# EAGLE design tactswitch (EAGLE 9.1.0)
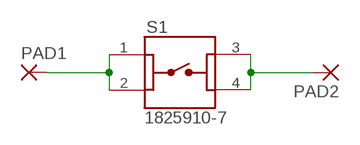
[diagram p0: schematic, sheet 1]

## Parts
PAD1  2,15/1,0  [2,15/1,0]
PAD2  2,15/1,0  [2,15/1,0]
S1  1825910-7  [SW_1825910-7]

## Nets
N$1: PAD1.1(P) S1.1 S1.2
N$2: PAD2.1(P) S1.3 S1.4

## Library data of the parts
PAD1 PAD2 = wirepad:2,15/1,0: THROUGH-HOLE PAD
S1 = tact:1825910-7: Switch Tactile OFF (ON) SPST Round Button PC Pins 0.05A 24VDC 100000Cycles 2.55N Thru-Hole Loose; COMMENT: 1825910-7; CONFIGURATION_POLE-THROW: Single Pole - Single Throw; CONTACT_CURRENT_RATING: 50 mA; DESCRIPTION: FSM4JAH=6MM TACT SWITCH, HIGH TEMP; DIGI-KEY_PART_NUMBER: 450-1804-ND; DIGI-KEY_PURCHASE_URL: https://www.digikey.com/product-detail/en/te-connectivity-alcoswitch-switches/1825910-7/450-1804-ND/1731414?utm_source=snapeda&utm_medium=aggregator&utm_campaign=symbol; EU_ROHS_COMPLIANCE: Compliant; LINK: http://www.te.com/usa-en/product-1825910-7.html; MF: TE Connectivity; MP: 1825910-7; PACKAGE: None

## Board
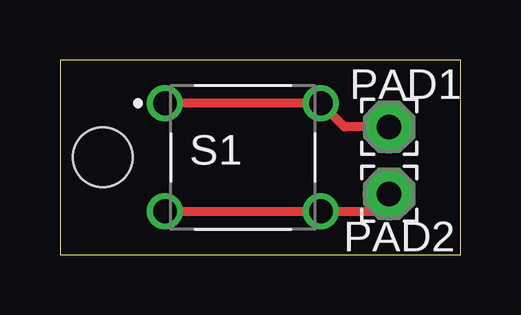
[diagram p1: board, top side]

Size 16.69 x 8.12 mm. Coordinates in mm from the lower left corner, seen from the top.
Outline: 0,0 16.69,0 16.69,8.12 0,8.12 0,0
Copper layers (1*16): Top 0.035mm / dielectric 1.5mm / Bottom 0.035mm
Design rules "oshpark": minimum track width 7mil, minimum drill 10mil, track to track 7mil, track to pad 7mil, pad to pad 7mil, via to via 7mil, smd to smd 6mil, copper to edge 10mil, drill to drill 6mil, minimum pad ring 10mil, minimum via ring 10mil, stop-mask expansion 2mil, vias tented up to drill 0mil, thermal gap 10mil
Holes 2.49 mm at 1.78,4.06

### Footprints (pad centres in the part's own frame; a part is rotated, then mirrored left to right if it is on the bottom)
2,15/1,0 = drill 1.016 pad 2.159 octagon: 1 0,0
SW_1825910-7 = drill 0.99: 1 -3.25,2.25; 2 3.25,2.25; 3 -3.25,-2.25; 4 3.25,-2.25

### Placement (x,y rotation side)
PAD1  13.72,5.33 0 top
PAD2  13.72,2.54 0 top
S1  7.62,4.06 0 top

### Tracks (layer width: path | path; a pad name or v marks a point on that pad's centre or on a via)
N$1
  Top 0.381: PAD1.1 11.85,5.33 S1.2 S1.1
N$2
  Top 0.381: S1.3 S1.4 12.99,1.81 PAD2.1